# EAGLE schematic TSOC-ESP8266-EM (EAGLE 6.6.0)
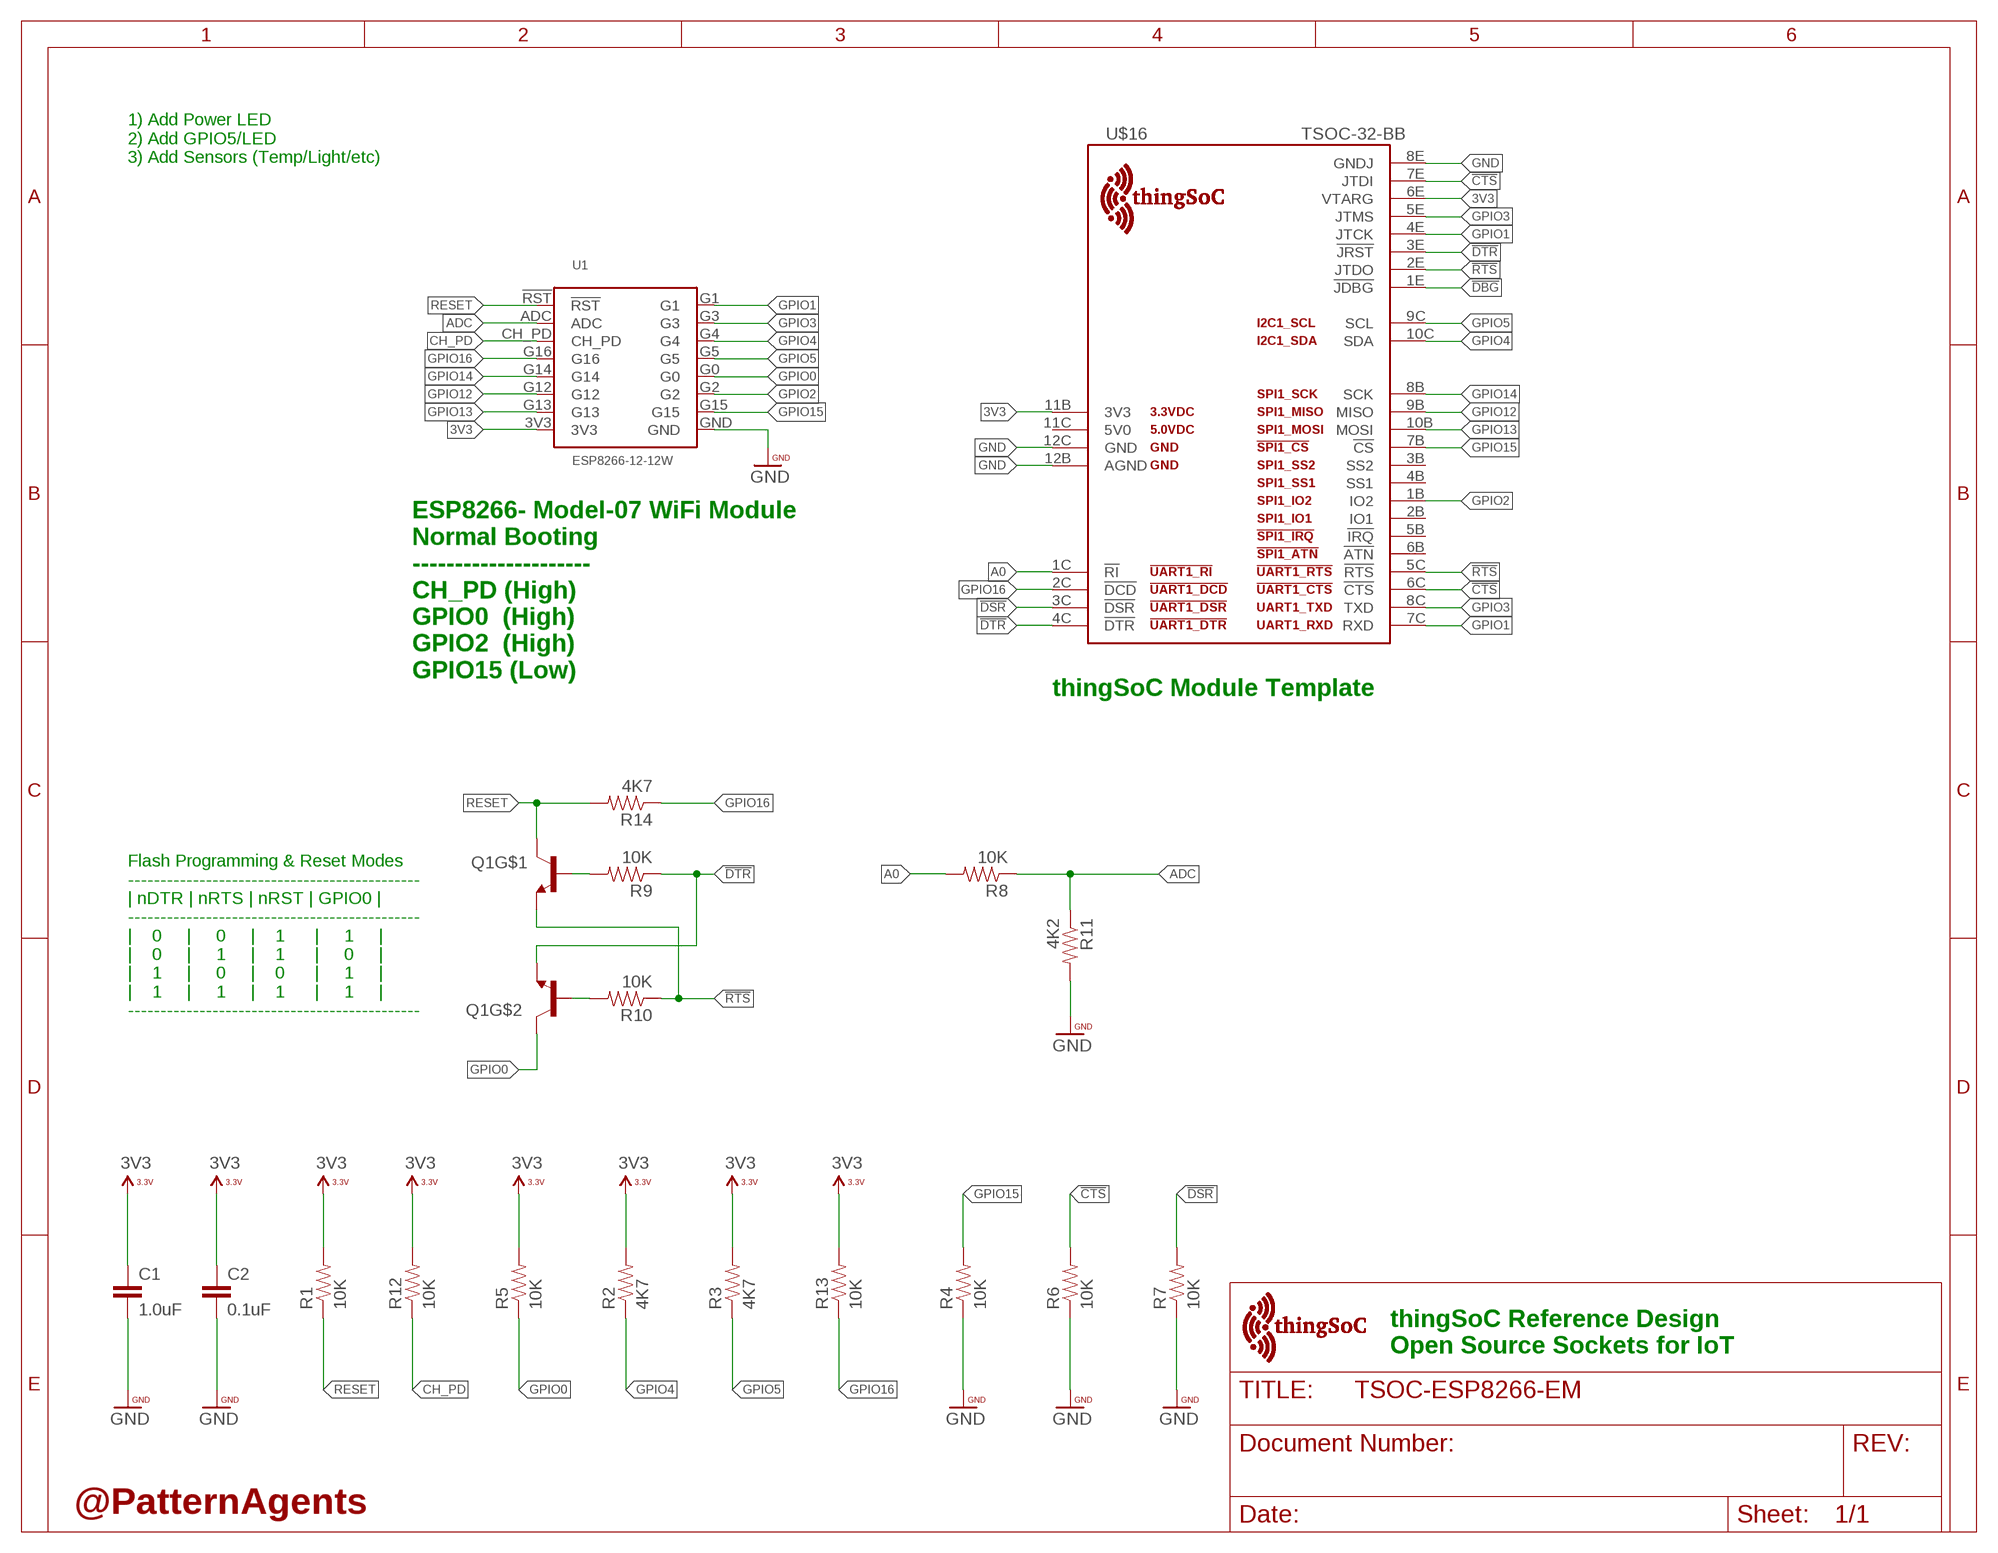
[diagram p0: schematic, sheet 1]

## Parts
C1  1.0uF  CAP0402-CAP  [0402-CAP]
C2  0.1uF  CAP0402-CAP  [0402-CAP]
Q1  MMBT2222A  MMDT3904  [SOT363]
R1  10K  RESISTOR0402  [0402-RES]
R2  4K7  RESISTOR0402  [0402-RES]
R3  4K7  RESISTOR0402  [0402-RES]
R4  10K  RESISTOR0402  [0402-RES]
R5  10K  RESISTOR0402  [0402-RES]
R6  10K  RESISTOR0402  [0402-RES]
R7  10K  RESISTOR0402  [0402-RES]
R8  10K  RESISTOR0402  [0402-RES]
R9  10K  RESISTOR0402  [0402-RES]
R10  10K  RESISTOR0402  [0402-RES]
R11  4K2  RESISTOR0402  [0402-RES]
R12  10K  RESISTOR0402  [0402-RES]
R13  10K  RESISTOR0402  [0402-RES]
R14  4K7  RESISTOR0402  [0402-RES]
U1  ESP8266-12-12W  [ESP8266-12W]
U$16  TSOC-32-BB  [TSOC-BB-S32]
U$19  TSOC-LOGO-SMALL  [TSOC-LOGO-SML]
U$20  TSOC-LOGO-SMALL  [TSOC-LOGO-SML]

## Nets
3V3: C1.1 C2.1 R1.2 R2.2 R3.2 R5.2 R12.2 R13.2 U1.3V3 U$16.6E(VTARG) U$16.11B(3V3)
!CTS: R6.2 U$16.6C(!CTS) U$16.7E(JTDI)
!DBG: U$16.1E(!JDBG)
!DSR: R7.2 U$16.3C(!DSR)
!DTR: Q1.1(E) R9.1 U$16.3E(!JRST) U$16.4C(!DTR)
!RTS: Q1.4(E) R10.1 U$16.2E(JTDO) U$16.5C(!RTS)
A0: R8.2 U$16.1C(!RI)
ADC: R8.1 R11.1 U1.ADC
CH_PD: R12.1 U1.CH_PD
GND: C1.2 C2.2 R4.1 R6.1 R7.1 R11.2 U1.GND U$16.8E(GNDJ) U$16.12B(AGND) U$16.12C(GND)
GPIO0: Q1.6(C) R5.1 U1.G0
GPIO1: U1.G1 U$16.4E(JTCK) U$16.7C(RXD)
GPIO2: U1.G2 U$16.1B(IO2)
GPIO3: U1.G3 U$16.5E(JTMS) U$16.8C(TXD)
GPIO4: R2.1 U1.G4 U$16.10C(SDA)
GPIO5: R3.1 U1.G5 U$16.9C(SCL)
GPIO12: U1.G12 U$16.9B(MISO)
GPIO13: U1.G13 U$16.10B(MOSI)
GPIO14: U1.G14 U$16.8B(SCK)
GPIO15: R4.2 U1.G15 U$16.7B(!CS)
GPIO16: R13.1 R14.1 U1.G16 U$16.2C(!DCD)
N$6: Q1.5(B) R9.2
N$12: Q1.2(B) R10.2
RESET: Q1.3(C) R1.1 R14.2 U1.!RST
Unconnected: U$16.2B(IO1) U$16.3B(SS2) U$16.4B(SS1) U$16.5B(!IRQ) U$16.6B(!ATN) U$16.11C(5V0)

## Notes on the sheet
- 1) Add Power LED
  2) Add GPIO5/LED
  3) Add Sensors (Temp/Light/etc)
- ESP8266- Model-07 WiFi Module
- Normal Booting
  ---------------------
  CH_PD (High)
  GPIO0  (High)
  GPIO2  (High) 
  GPIO15 (Low)
- thingSoC Module Template
- Flash Programming & Reset Modes
  ---------------------------------------------
  | nDTR | nRTS | nRST | GPIO0 |
  ---------------------------------------------
  |    0     |     0     |    1      |     1     |
  |    0     |     1     |    1      |     0     |
  |    1     |     0     |    0      |     1     |
  |    1     |     1     |    1      |     1     |
  ---------------------------------------------
- thingSoC Reference Design
  Open Source Sockets for IoT
- @PatternAgents

## Library data of the parts
C1 C2 = PatternAgents-ProtoPads:CAP: Capacitor Standard 0603 ceramic capacitor, and 0.1" leaded capacitor.
Q1 = SparkFun-DiscreteSemi:MMDT3904: Dual NPN transistor
R1-R14 = PatternAgents-ProtoPads:RESISTOR: Resistor Basic schematic elements and footprints for 0603, 1206, and PTH resistors.
U1 = PatternAgents_RFmodules:ESP8266-12: Pattern Agents ESP8266 (Type12 : 16 Pins) PatternAgents Prototyping/Pads Library Schematic & PCB Layout Symbols for Prototyping Boards. Pads in this library have been lengthened for hand soldering & prototyping. Schematic and PCB layout libraries for design patterns by PatternAgents. For the CADSoft Eagle CAD program : http://www.cadsoftusa.com/download-eagle/ Github : https://github.com/PatternAgents License : http://creativecommons.org/licenses/by-sa/4.0/ (Creative Commons 4.0) THIS SOFTWARE IS PROVIDED BY THE CONTRIBUTORS "AS IS" AND WITHOUT ANY EXPRESS OR IMPLIED WARRANTIES, INCLUDING, BUT NOT LIMITED TO, THE IMPLIED WARRANTIES OF MERCHANTABILITY AND FITNESS FOR A PARTICULAR PURPOSE ARE DISCLAIMED. IN NO EVENT SHALL THE COPYRIGHT OWNER OR CONTRIBUTORS BE LIABLE FOR ANY DIRECT, INDIRECT, INCIDENTAL, SPECIAL, EXEMPLARY, OR CONSEQUENTIAL DAMAGES (INCLUDING, BUT NOT LIMITED TO, PROCUREMENT OF SUBSTITUTE GOODS OR SERVICES; LOSS OF USE, DATA, OR PROFITS; OR BUSINESS INTERRUPTION) HOWEVER CAUSED AND ON ANY THEORY OF LIABILITY, WHETHER IN CONTRACT, STRICT LIABILITY, OR TORT (INCLUDING NEGLIGENCE OR OTHERWISE) ARISING IN ANY WAY OUT OF THE USE OF THIS SOFTWARE, EVEN IF ADVISED OF THE POSSIBILITY OF SUCH DAMAGE.
U$16 = thingSoC:TSOC-32: thingSoC Thirty-Two (32) Pin Socket Source LBR : http://www.thingsoc.com Github : https://github.com/thingsoc License : http://creativecommons.org/licenses/by-sa/4.0/ (Creative Commons 4.0) THIS SOFTWARE IS PROVIDED BY THE CONTRIBUTORS "AS IS" AND WITHOUT ANY EXPRESS OR IMPLIED WARRANTIES, INCLUDING, BUT NOT LIMITED TO, THE IMPLIED WARRANTIES OF MERCHANTABILITY AND FITNESS FOR A PARTICULAR PURPOSE ARE DISCLAIMED. IN NO EVENT SHALL THE COPYRIGHT OWNER OR CONTRIBUTORS BE LIABLE FOR ANY DIRECT, INDIRECT, INCIDENTAL, SPECIAL, EXEMPLARY, OR CONSEQUENTIAL DAMAGES (INCLUDING, BUT NOT LIMITED TO, PROCUREMENT OF SUBSTITUTE GOODS OR SERVICES; LOSS OF USE, DATA, OR PROFITS; OR BUSINESS INTERRUPTION) HOWEVER CAUSED AND ON ANY THEORY OF LIABILITY, WHETHER IN CONTRACT, STRICT LIABILITY, OR TORT (INCLUDING NEGLIGENCE OR OTHERWISE) ARISING IN ANY WAY OUT OF THE USE OF THIS SOFTWARE, EVEN IF ADVISED OF THE POSSIBILITY OF SUCH DAMAGE.
U$19 U$20 = thingSoC:TSOC-LOGO: thingSoC Logo Source LBR : http://www.thingsoc.com Github : https://github.com/thingsoc License : http://creativecommons.org/licenses/by-sa/4.0/ (Creative Commons 4.0) THIS SOFTWARE IS PROVIDED BY THE CONTRIBUTORS "AS IS" AND WITHOUT ANY EXPRESS OR IMPLIED WARRANTIES, INCLUDING, BUT NOT LIMITED TO, THE IMPLIED WARRANTIES OF MERCHANTABILITY AND FITNESS FOR A PARTICULAR PURPOSE ARE DISCLAIMED. IN NO EVENT SHALL THE COPYRIGHT OWNER OR CONTRIBUTORS BE LIABLE FOR ANY DIRECT, INDIRECT, INCIDENTAL, SPECIAL, EXEMPLARY, OR CONSEQUENTIAL DAMAGES (INCLUDING, BUT NOT LIMITED TO, PROCUREMENT OF SUBSTITUTE GOODS OR SERVICES; LOSS OF USE, DATA, OR PROFITS; OR BUSINESS INTERRUPTION) HOWEVER CAUSED AND ON ANY THEORY OF LIABILITY, WHETHER IN CONTRACT, STRICT LIABILITY, OR TORT (INCLUDING NEGLIGENCE OR OTHERWISE) ARISING IN ANY WAY OUT OF THE USE OF THIS SOFTWARE, EVEN IF ADVISED OF THE POSSIBILITY OF SUCH DAMAGE.